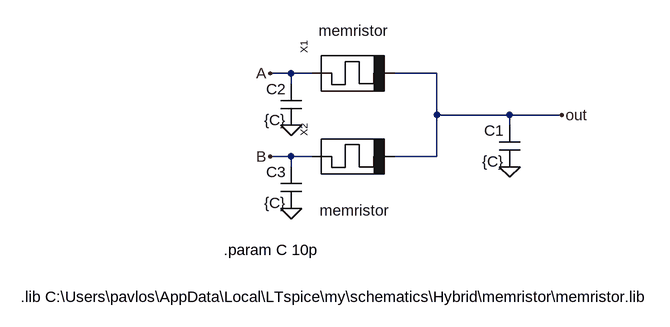
[diagram p0: schematic or.asc]
or.asc, the LTspice schematic file:
Version 4
SHEET 1 880 680
WIRE -384 -432 -416 -432
WIRE -352 -432 -384 -432
WIRE -160 -432 -224 -432
WIRE -384 -416 -384 -432
WIRE -160 -368 -160 -432
WIRE -48 -368 -160 -368
WIRE 32 -368 -48 -368
WIRE -48 -352 -48 -368
WIRE -384 -304 -416 -304
WIRE -352 -304 -384 -304
WIRE -160 -304 -160 -368
WIRE -160 -304 -224 -304
WIRE -384 -288 -384 -304
FLAG 32 -368 out
FLAG -416 -432 A
FLAG -416 -304 B
FLAG -48 -288 0
FLAG -384 -352 0
FLAG -384 -224 0
SYMBOL cap -32 -352 M0
SYMATTR InstName C1
SYMATTR Value {C}
SYMBOL memristor -288 -432 R270
WINDOW 3 81 0 VBottom 2
WINDOW 39 61 -9 VBottom 2
SYMATTR InstName X1
SYMBOL memristor -288 -304 R270
WINDOW 3 -68 2 VBottom 2
WINDOW 39 -94 3 VBottom 2
SYMATTR InstName X2
SYMBOL cap -368 -416 M0
SYMATTR InstName C2
SYMATTR Value {C}
SYMBOL cap -368 -288 M0
SYMATTR InstName C3
SYMATTR Value {C}
TEXT -488 -160 Left 2 !.param C 10p
TEXT -800 -88 Left 2 !.lib C:\\Users\\pavlos\\AppData\\Local\\LTspice\\my\\schematics\\Hybrid\\memristor\\memristor.lib

The netlist it stands for:
* or.asc
C1 out 0 {C}
XX1 A out memristor  ; pins plus minus
XX2 B out memristor  ; pins plus minus
C2 A 0 {C}
C3 B 0 {C}
.param C 10p
.lib C:\Users\pavlos\AppData\Local\LTspice\my\schematics\Hybrid\memristor\memristor.lib
.backanno
.end